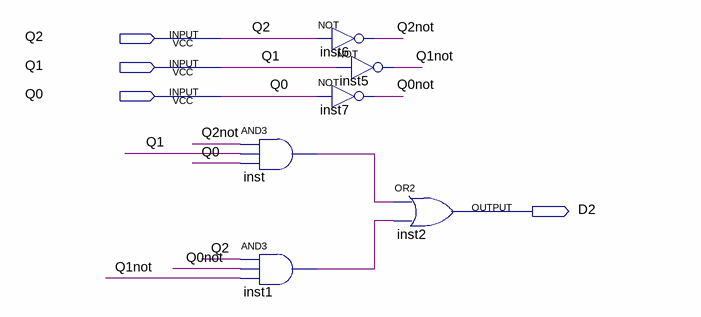
[diagram p0: schematic sheet]
// Quartus schematic D2.bdf as structural Verilog: 6 symbols, 4 pins
module D2 (
  input  Q2,
  input  Q1,
  input  Q0,
  output D2
);

  wire inst1_out, inst_out, Q0not, Q1not, Q2not;

  and inst (inst_out, Q2not, Q1, Q0);
  and inst1 (inst1_out, Q2, Q0not, Q1not);
  not inst6 (Q2not, Q2);
  not inst7 (Q0not, Q0);
  not inst5 (Q1not, Q1);
  or inst2 (D2, inst_out, inst1_out);
endmodule
